# EAGLE schematic r0.4.0 (EAGLE 7.2.0)
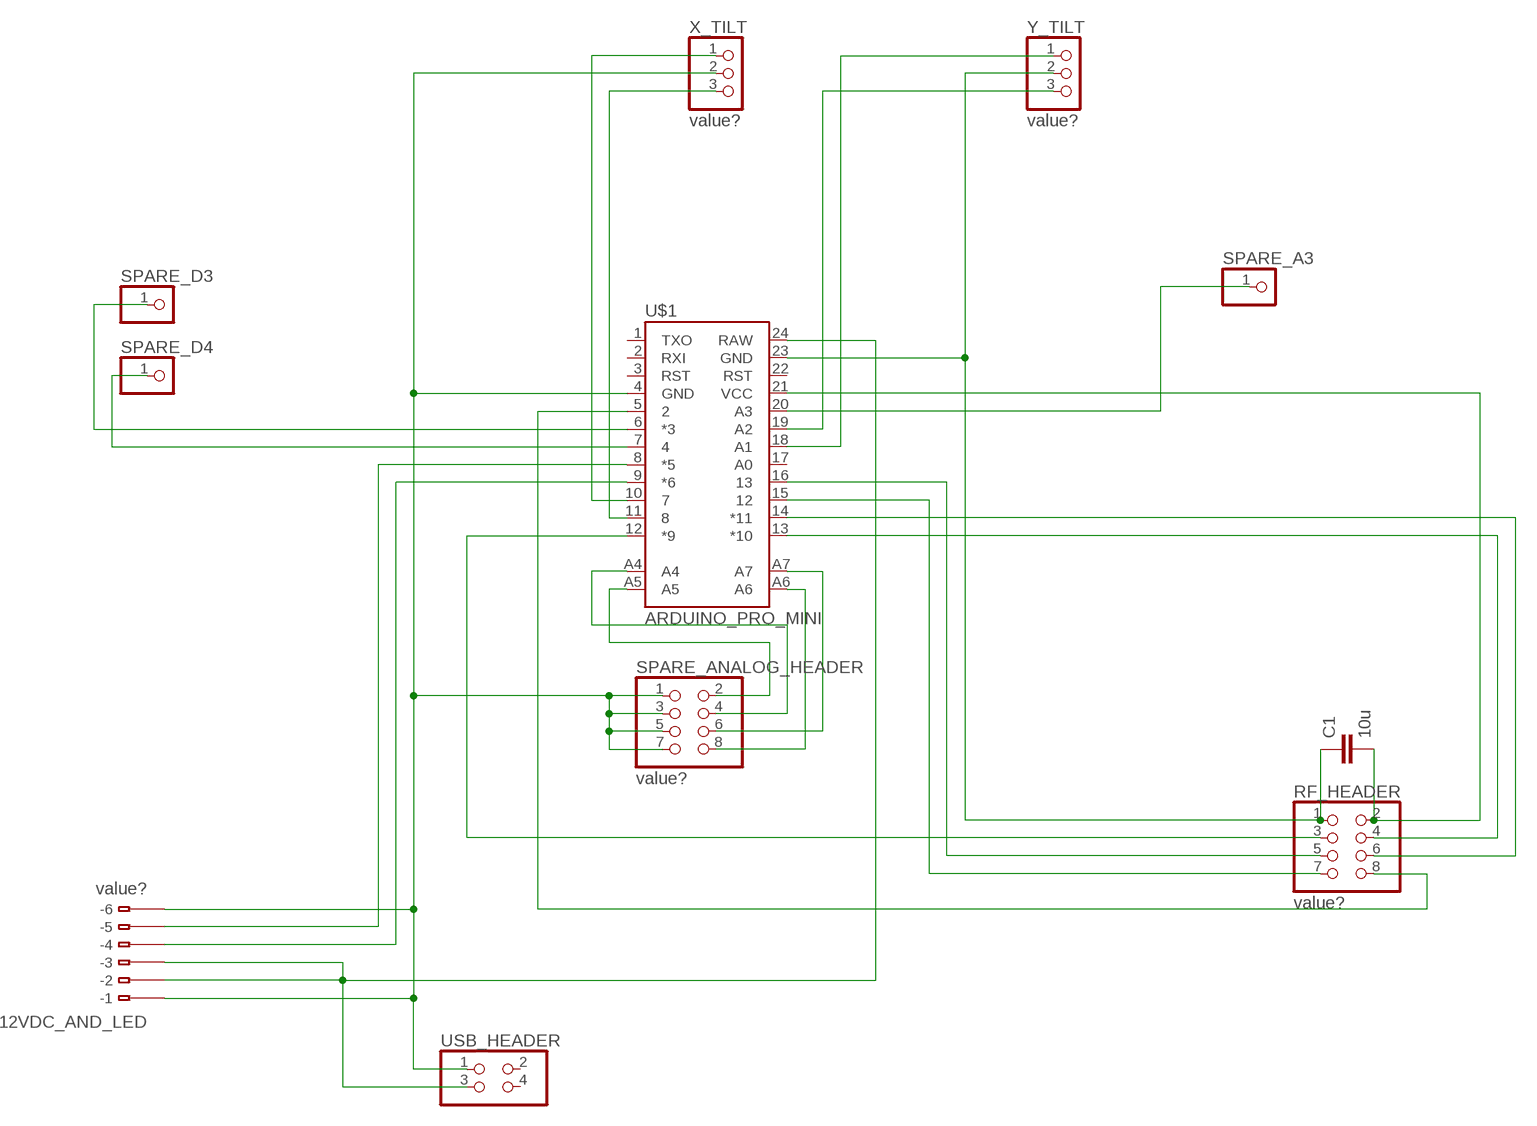
[diagram p0: schematic, sheet 1]

## Parts
12VDC_AND_LED  value?  234-206  [234-206]
C1  10u  CAPPTH  [CAP-PTH-SMALL]
RF_HEADER  value?  PINHD-2X4  [2X04]
SPARE_A3  PINHD-1X1  [1X01]
SPARE_ANALOG_HEADER  value?  PINHD-2X4  [2X04]
SPARE_D3  PINHD-1X1  [1X01]
SPARE_D4  PINHD-1X1  [1X01]
U$1  ARDUINO_PRO_MINI  [ARDUINO_PRO_MINI]
USB_HEADER  PINHD-2X2  [2X02]
X_TILT  value?  PINHD-1X3  [1X03]
Y_TILT  value?  PINHD-1X3  [1X03]

## Nets
N$1: U$1.10 X_TILT.1
N$4: 12VDC_AND_LED.B1(B-1) 12VDC_AND_LED.B6(B-6) SPARE_ANALOG_HEADER.1 SPARE_ANALOG_HEADER.3 SPARE_ANALOG_HEADER.5 SPARE_ANALOG_HEADER.7 U$1.4(GND) USB_HEADER.1 X_TILT.2
N$6: U$1.11 X_TILT.3
N$7: 12VDC_AND_LED.B5(B-5) U$1.8(*5)
N$9: 12VDC_AND_LED.B2(B-2) 12VDC_AND_LED.B3(B-3) U$1.24(RAW) USB_HEADER.3
N$10: C1.1 RF_HEADER.1 U$1.23(GND) Y_TILT.2
N$11: 12VDC_AND_LED.B4(B-4) U$1.9(*6)
N$12: SPARE_ANALOG_HEADER.4 U$1.A4
N$14: U$1.19(A2) Y_TILT.3
N$15: RF_HEADER.3 U$1.12(*9)
N$16: RF_HEADER.4 U$1.13(*10)
N$17: RF_HEADER.6 U$1.14(*11)
N$18: SPARE_ANALOG_HEADER.2 U$1.A5
N$19: SPARE_ANALOG_HEADER.8 U$1.A6
N$20: SPARE_ANALOG_HEADER.6 U$1.A7
N$21: RF_HEADER.7 U$1.15
N$23: RF_HEADER.5 U$1.16
N$25: RF_HEADER.8 U$1.5
N$27: U$1.18(A1) Y_TILT.1
N$28: SPARE_A3.1 U$1.20(A3)
N$29: SPARE_D3.1 U$1.6(*3)
N$30: SPARE_D4.1 U$1.7
Y_TILT: C1.2 RF_HEADER.2 U$1.21(VCC)
Unconnected: 12VDC_AND_LED.A1(-1) 12VDC_AND_LED.A2(-2) 12VDC_AND_LED.A3(-3) 12VDC_AND_LED.A4(-4) 12VDC_AND_LED.A5(-5) 12VDC_AND_LED.A6(-6) U$1.1(TXO) U$1.2(RXI) U$1.3(RST) U$1.17(A0) U$1.22(RST) USB_HEADER.2 USB_HEADER.4

## Library data of the parts
12VDC_AND_LED = con-wago:234-206: WAGO Cage Clamp; MPN: 234-206; OC_FARNELL: unknown; OC_NEWARK: 28K9095
C1 = SparkFun-Passives:CAP: Capacitor Standard 0603 ceramic capacitor, and 0.1" leaded capacitor.
RF_HEADER SPARE_ANALOG_HEADER = rf-header:PINHD-2X4: PIN HEADER
SPARE_A3 SPARE_D3 SPARE_D4 = pinhead:PINHD-1X1: PIN HEADER
U$1 = SparkFun-Boards:ARDUINO_PRO_MINI
USB_HEADER = usb-header:PINHD-2X2: PIN HEADER
X_TILT Y_TILT = pinhead:PINHD-1X3: PIN HEADER